# Altium project Test.PrjPcb
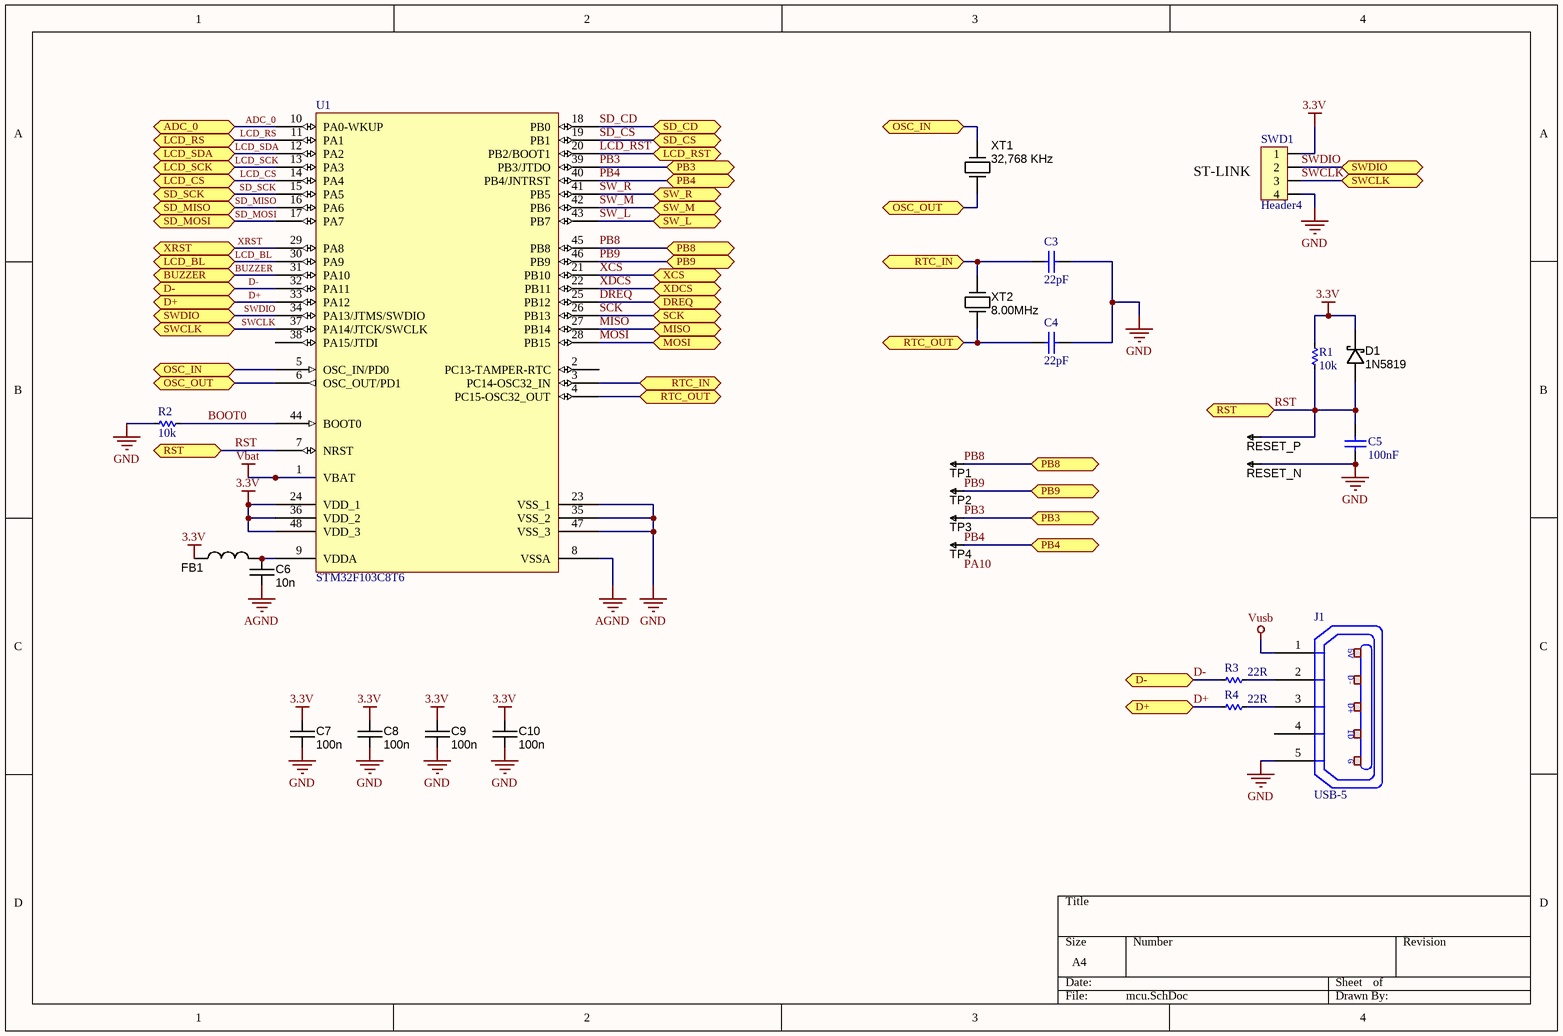
[diagram p0: mcu.SchDoc]
4 sheets, 115 parts. Net scope: flat (ports and power ports of the same name join across sheets).
Board file: PCB.PcbDoc
Sheets:
  mcu.SchDoc
  vs1003.SchDoc
  multimedia.SchDoc
  psu.SchDoc

## Sheet mcu.SchDoc
size A4

### Parts
C3  value 22pF  [C0805]  (hidden comment: Cap Semi)
C4  value 22pF  [C0805]  (hidden comment: Cap Semi)
C5  value 100nF  [C0805]  (hidden comment: Cap Semi)
C6  value 10n  [CAPC1608X90N]  (hidden comment: approved sub OK)
C7  value 100n  [CAPC1608X90N]  (hidden comment: approved sub OK)
C8  value 100n  [CAPC1608X90N]  (hidden comment: approved sub OK)
C9  value 100n  [CAPC1608X90N]  (hidden comment: approved sub OK)
C10  value 100n  [CAPC1608X90N]  (hidden comment: approved sub OK)
D1  Manufacturer Part Number 1: 1N5819  [SOD123]  (hidden comment: DIODE_SCHOTTKY_40V_1A)
FB1  2K2 @ 100 MHz  [FBC2012N]  (value not drawn)
J1  USB-5  [USB-M1]
R1  value 10k  [RES-SMD-0805]  (hidden comment: Res)
R2  value 10k  [RES-SMD-0603]  (hidden comment: Res)
R3  value 22R  [RES-SMD-0603]  (hidden comment: Res)
R4  value 22R  [RES-SMD-0603]  (hidden comment: Res)
RESET_N  TESTPOINT  [TP-R60]  (value not drawn)  (no BOM)
RESET_P  TESTPOINT  [TP-R60]  (value not drawn)  (no BOM)
SWD1  Header4  [HDR4]
TP1  TESTPOINT  [TP-R60]  (value not drawn)  (no BOM)
TP2  TESTPOINT  [TP-R60]  (value not drawn)  (no BOM)
TP3  TESTPOINT  [TP-R60]  (value not drawn)  (no BOM)
TP4  TESTPOINT  [TP-R60]  (value not drawn)  (no BOM)
U1  STM32F103C8T6  [LQFP48_N]
XT1  32,768 KHz  [CRYSTAL_CMR309T]
XT2  8.00MHz  [CRYSTAL_HC49-US-SM]

### Ports
ADC_0, BUZZER, D+, D-, DREQ, LCD_BL, LCD_CS, LCD_RS, LCD_RST, LCD_SCK, LCD_SDA, MISO, MOSI, OSC_IN, OSC_OUT, PB3, PB4, PB8, PB9, RST, RTC_IN, RTC_OUT, SCK, SD_CD, SD_CS, SD_MISO, SD_MOSI, SD_SCK, SW_L, SW_M, SW_R, SWCLK, SWDIO, XCS, XDCS, XRST

### Nets
3.3V: C7.1 C8.1 C9.1 C10.1 D1.K FB1.1 R1.1 SWD1.1 U1.24(VDD_1) U1.36(VDD_2) U1.48(VDD_3)
AGND: C6.2 U1.8(VSSA)
GND: C3.1 C4.1 C5.1 C7.2 C8.2 C9.2 C10.2 J1.5(P5) R2.2 RESET_N.1 SWD1.4 U1.23(VSS_1) U1.35(VSS_2) U1.47(VSS_3)
Vbat: U1.1(VBAT)  [project net Charger_Output]
Vusb: J1.1(P1)
ADC_0: U1.10(PA0-WKUP) ; port ADC_0
BOOT0: R2.1 U1.44(BOOT0)
BUZZER: U1.31(PA10) ; port BUZZER
D+: R4.2 U1.33(PA12) ; port D+
D-: R3.2 U1.32(PA11) ; port D-
DREQ: U1.25(PB12) ; port DREQ
LCD_BL: U1.30(PA9) ; port LCD_BL
LCD_CS: U1.14(PA4) ; port LCD_CS
LCD_RS: U1.11(PA1) ; port LCD_RS
LCD_RST: U1.20(PB2/BOOT1) ; port LCD_RST
LCD_SCK: U1.13(PA3) ; port LCD_SCK
LCD_SDA: U1.12(PA2) ; port LCD_SDA
MISO: U1.27(PB14) ; port MISO
MOSI: U1.28(PB15) ; port MOSI
PB3: TP3.1 U1.39(PB3/JTDO) ; port PB3
PB4: TP4.1 U1.40(PB4/JNTRST) ; port PB4
PB8: TP1.1 U1.45(PB8) ; port PB8
PB9: TP2.1 U1.46(PB9) ; port PB9
RST: C5.2 D1.A R1.2 RESET_P.1 U1.7(NRST) ; port RST
SCK: U1.26(PB13) ; port SCK
SD_CD: U1.18(PB0) ; port SD_CD
SD_CS: U1.19(PB1) ; port SD_CS
SD_MISO: U1.16(PA6) ; port SD_MISO
SD_MOSI: U1.17(PA7) ; port SD_MOSI
SD_SCK: U1.15(PA5) ; port SD_SCK
SW_L: U1.43(PB7) ; port SW_L
SW_M: U1.42(PB6) ; port SW_M
SW_R: U1.41(PB5) ; port SW_R
SWCLK: SWD1.3 U1.37(PA14/JTCK/SWCLK) ; port SWCLK
SWDIO: SWD1.2 U1.34(PA13/JTMS/SWDIO) ; port SWDIO
XCS: U1.21(PB10) ; port XCS
XDCS: U1.22(PB11) ; port XDCS
XRST: U1.29(PA8) ; port XRST
NetC3_2: C3.2 U1.3(PC14-OSC32_IN) XT2.2(OUT) ; port RTC_IN
NetC4_2: C4.2 U1.4(PC15-OSC32_OUT) XT2.1(IN) ; port RTC_OUT
NetC6_1: C6.1 FB1.2 U1.9(VDDA)
NetJ1_2: J1.2(P2) R3.1
NetJ1_3: J1.3(P3) R4.1
NetU1_5: U1.5(OSC_IN/PD0) XT1.2(OUT) ; port OSC_IN
NetU1_6: U1.6(OSC_OUT/PD1) XT1.1(IN) ; port OSC_OUT

Not connected (* = marked no-connect by the designer): J1 4(P4); U1 2(PC13-TAMPER-RTC) 38(PA15/JTDI)

### Notes on the sheet
- (near SWD1) ST-LINK
- Labels drawn without touching a wire or pin: PA10
- (in symbol USB-5) 5V; D-; D+; ID; G

### Library data of the parts
C3-C5 = Cap Semi: Capacitor (Semiconductor SIM Model); Published: 8-Jun-2000; LatestRevisionDate: 29-May-2009; LatestRevisionNote: IPC-7351 Footprint Added.; PackageReference: C1206; Publisher: Altium Limited; PackageDescription: Chip Capacitor
C6-C10 = CAPC_100n_0603_X7R_50V_10%: Capacitor SMD Cer 100nF 10% 50V X7R 0603; Manufacturer 1: AVX Corporation; Manufacturer Part Number 1: 06035C104KAT2A; Ratings: 50V; X7R; Material: ceramic; SCDType: spec; Manufacturer 2: TDK Corporation; Manufacturer Part Number 2: C1608X7R1H104K; Package / Case: 0603 (1608 Metric); Tolerance: ±10%; Supplier 1: Digi-Key; Supplier Part Number 1: 478-5052-1-ND; ComponentLink1URL: http://www.avx.com/docs/Catalogs/cx7r.pdf; ComponentLink1Description: http://www.avx.com/docs/Catalogs/cx7r.pdf; Supplier 2: Digi-Key; Supplier Part Number 2: 445-1314-1-ND; ComponentLink2URL: http://product.tdk.com/capacitor/mlcc/en/documents/mlcc_commercial_general_en.pdf; ComponentLink2Description: http://product.tdk.com/capacitor/mlcc/en/documents/mlcc_commercial_general_en.pdf
D1 = DIODE_SCHOTTKY_40V_1A: Diode Schottky SMD 40V 1A SOD123; Manufacturer 1: Diodes Inc; Ratings: 40V; 1A; Material: Si; SCDType: spec; Package / Case: SOD123; Diode Type: Schottky; Mounting Type: Surface Mount; Supplier 1: Digi-Key; Supplier Part Number 1: 1N5819HW-FDICT-ND
FB1 = FERRITE_2K2-100MHz_0805: Ferrite bead 2.2K Ohm at 100 MHz 200mA 0805 SMD; Manufacturer 1: Laird-Signal Integrity Products; Manufacturer Part Number 1: HZ0805B222R-10; Ratings: 200 mA; 800 mOhm DC; Impedance @ Frequency: 600 Ohm @ 100MHz; DC Resistance (DCR): 800 mOhm Max; Filter Type: Differential Mode - Single; SCDType: source; Size / Dimension: 0.063" L x 0.031" W (1.60mm x 0.80mm); Current Rating: 200mA; Package / Case: 0805 (2012 Metric); Height (Max): 0.043" (1.09mm); ComponentLink1URL: http://www.lairdtech.com/WorkArea/linkit.aspx?LinkIdentifier=id&ItemID=4879; ComponentLink1Description: http://www.lairdtech.com/WorkArea/linkit.aspx?LinkIdentifier=id&ItemID=4879; Supplier 1: Digi-Key; Supplier Part Number 1: 240-2562-1-ND; Mounting Type: Surface Mount; Value: 2K2 @ 100 MHz
J1 = USB-5: Manufacturer: FCI; Manufacturer Part Number: 10118193-0001LF; Connector Type: USB - micro B; Number of Contacts: 5; Gender: Receptacle; Specifications: USB 2.0; .Creator: MM; .Checked PCB: RF; Supplier 1: Digi-Key; RoHS: RoHS Compliant; Category: Connectors, Interconnects; Stock 1: 28642; Pricing 1: 1=0.46, 10=0.433, 25=0.3712, 50=0.3156, 100=0.3032, 250=0.27224, 500=0.25988 (USD); Packaging: Cut Tape (CT); Mounting Type: Surface Mount, Right Angle, Horizontal; Features: Shielded, Solder Retention; Ingress Protection: -; ComponentLink1URL: http://portal.fciconnect.com/Comergent//fci/drawing/10118193.pdf; ComponentLink1Description: http://portal.fciconnect.com/Comergent//fci/drawing/10118193.pdf; Supplier Part Number 1: 609-4616-1-ND; .Checked SCH: MM
R1-R4 = Res-SMD: Resistor; Manufacturer: Generic Components; Class: Passive; Published: 08/06/2000; Publisher: Altium Hobart Technology Centre
RESET_N RESET_P TP1-TP4 = TESTPOINT: SMD test pin
SWD1 = Header4: Header IDC, 4 x 1 Pin Vertical 2.54mm Pitch (Non-Boxed, Male); Manufacturer: W¨¹rth Elektronik eiSos GmbH; partNo: 613002143121; ComponentLink1 Description: Manufacturer; ComponentLink2 Description: Datasheet; NoPins: 02; Created Date: 29 March 2013; ComponentLink1URL: http://www.we-online.com; ComponentLink2URL: http://katalog.we-online.de/em/datasheet/6130xx143121.pdf; Created by: Karrer Zheng
U1 = STM32F103C8T6: STM32 ARM-based 32-bit MCU with 64 Kbytes Flash, 48-pin LQFP, Industrial Temperature; Published: 30-May-2008; DatasheetVersion: rev6, Mar-2008; PackageVersion: Mar-2008; PackageReference: LQFP48; Publisher: Altium Limited; PackageDescription: 48-Pin Low-Profile Quad Flat Pack, 7 x 7 mm Body, 0.5 mm Pitch (LQFP48); ComponentLink1Description: Manufacturer Link; ComponentLink1URL: www.st.com/stm32; ComponentLink2Description: Datasheet; ComponentLink2URL: http://www.st.com/stonline/products/literature/ds/13587.pdf
XT1 = Crystal_6MHz_CMR309T: Resonator Ceramic 6.00 MHz 30ppm; Manufacturer 1: Citizen Finetech Miyota; Manufacturer Part Number 1: CMR309T-6.000MABJ-UT; Frequency: 6MHz; Frequency Stability: ±50ppm; Load Capacitance: 18pF; Operating Mode: Fundamental; SCDType: spec; Package / Case: Cylindrical Can, Radial; Ratings: 6.00 MHz; Type: MHz Crystal; Frequency Tolerance: ±30ppm; Operating Temperature: -10°C ~ 60°C; Mounting Type: Surface Mount; Size / Dimension: 0.118" Dia x 0.346" L (3.00mm x 8.80mm); Height: 0.122" (3.10mm); Supplier 1: Digi-Key; Supplier Part Number 1: 300-8348-1-ND; Tolerance: ±50ppm; ComponentLink1URL: http://media.digikey.com/pdf/Data%20Sheets/Citizen%20PDFs/CMR310T%20CMR309T.pdf; ComponentLink1Description: http://media.digikey.com/pdf/Data%20Sheets/Citizen%20PDFs/CMR310T%20CMR309T.pdf; Value: 32,768 KHz
XT2 = Crystal_6MHz_HC49/US: Resonator Ceramic 6.00 MHz 30ppm; Manufacturer 1: CTS-Frequency Controls; Manufacturer Part Number 1: ATS060BSM-1; Frequency: 6MHz; Frequency Stability: ±50ppm; Load Capacitance: 18pF; Operating Mode: Fundamental; Parameter Name: 0.169" (4.30mm); SCDType: spec; Package / Case: HC49/US-SM; Ratings: 6.00 MHz; Supplier 1: Digi-Key; Supplier Part Number 1: CTX882CT-ND; Type: MHz Crystal; Frequency Tolerance: ±30ppm; Operating Temperature: -20°C ~ 70°C; Mounting Type: Surface Mount; Size / Dimension: 0.437" L x 0.190" W (11.10mm x 4.83mm); ComponentLink1URL: http://www.ctscorp.com/components/Datasheets/008-0309-0.pdf; ComponentLink1Description: http://www.ctscorp.com/components/Datasheets/008-0309-0.pdf

## Sheet vs1003.SchDoc
size A4
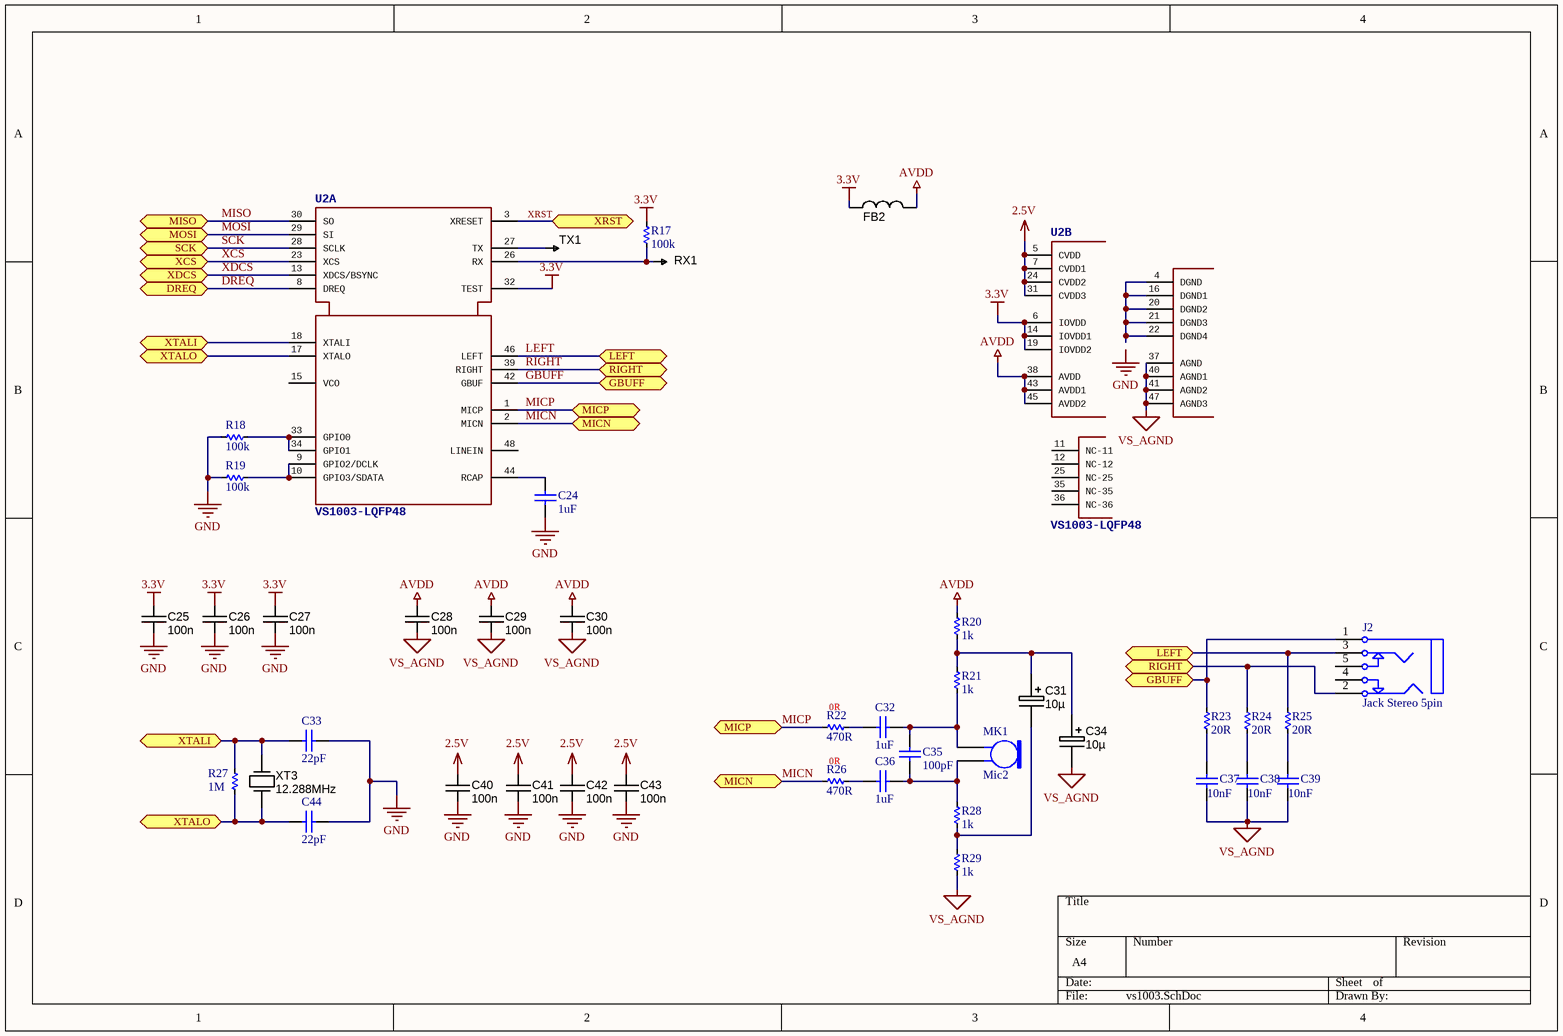
[diagram p1: vs1003.SchDoc]

### Parts
C24  value 1uF  [C0805]  (hidden comment: Cap Semi)
C25  value 100n  [CAPC1608X90N]  (hidden comment: approved sub OK)
C26  value 100n  [CAPC1608X90N]  (hidden comment: approved sub OK)
C27  value 100n  [CAPC1608X90N]  (hidden comment: approved sub OK)
C28  value 100n  [CAPC1608X90N]  (hidden comment: approved sub OK)
C29  value 100n  [CAPC1608X90N]  (hidden comment: approved sub OK)
C30  value 100n  [CAPC1608X90N]  (hidden comment: approved sub OK)
C31  10µ  [CAPMP3216X180N]
C32  value 1uF  [C0805]  (hidden comment: Cap Semi)
C33  value 22pF  [C0805]  (hidden comment: Cap Semi)
C34  10µ  [CAPMP3216X180N]
C35  value 100pF  [C0805]  (hidden comment: Cap Semi)
C36  value 1uF  [C0805]  (hidden comment: Cap Semi)
C37  value 10nF  [C0805]  (hidden comment: Cap Semi)
C38  value 10nF  [C0805]  (hidden comment: Cap Semi)
C39  value 10nF  [C0805]  (hidden comment: Cap Semi)
C40  value 100n  [CAPC1608X90N]  (hidden comment: approved sub OK)
C41  value 100n  [CAPC1608X90N]  (hidden comment: approved sub OK)
C42  value 100n  [CAPC1608X90N]  (hidden comment: approved sub OK)
C43  value 100n  [CAPC1608X90N]  (hidden comment: approved sub OK)
C44  value 22pF  [C0805]  (hidden comment: Cap Semi)
FB2  2K2 @ 100 MHz  [FBC2012N]  (value not drawn)
J2  Jack Stereo 5pin  [Audio Jack 5 pin]
MK1  Mic2  [PIN2]
R17  value 100k  [RES-SMD-0805]  (hidden comment: Res)
R18  value 100k  [RES-SMD-0603]  (hidden comment: Res)
R19  value 100k  [RES-SMD-0603]  (hidden comment: Res)
R20  value 1k  [RES-SMD-0603]  (hidden comment: Res)
R21  value 1k  [RES-SMD-0603]  (hidden comment: Res)
R22  value 470R  [RES-SMD-0603]  (hidden comment: Res)
R23  value 20R  [RES-SMD-0805]  (hidden comment: Res)
R24  value 20R  [RES-SMD-0805]  (hidden comment: Res)
R25  value 20R  [RES-SMD-0805]  (hidden comment: Res)
R26  value 470R  [RES-SMD-0603]  (hidden comment: Res)
R27  value 1M  [RES-SMD-0805]  (hidden comment: Res)
R28  value 1k  [RES-SMD-0603]  (hidden comment: Res)
R29  value 1k  [RES-SMD-0603]  (hidden comment: Res)
RX1  TESTPOINT  [TP-R60]  (value not drawn)  (no BOM)
TX1  TESTPOINT  [TP-R60]  (value not drawn)  (no BOM)
U2  VS1003-LQFP48  [LQFP48]  (parts A,B of 2)
XT3  12.288MHz  [CRYSTAL_HC49-US-SM]

### Ports
DREQ, GBUFF, LEFT, MICN, MICP, MISO, MOSI, RIGHT, SCK, XCS, XDCS, XRST, XTALI, XTALO

### Nets
2.5V: C40.1 C41.1 C42.1 C43.1 U2.5(CVDD) U2.7(CVDD1) U2.24(CVDD2) U2.31(CVDD3)
3.3V: C25.1 C26.1 C27.1 FB2.1 R17.1 U2.6(IOVDD) U2.14(IOVDD1) U2.19(IOVDD2) U2.32(TEST)
AVDD: C28.1 C29.1 C30.1 FB2.2 R20.1 U2.38(AVDD) U2.43(AVDD1) U2.45(AVDD2)
GND: C24.1 C25.2 C26.2 C27.2 C33.1 C40.2 C41.2 C42.2 C43.2 C44.1 R18.1 R19.1
VS_AGND: C28.2 C29.2 C30.2 C34.2 C37.1 C38.1 C39.1 R29.2 U2.37(AGND) U2.40(AGND1) U2.41(AGND2) U2.47(AGND3)
DREQ: U2.8(DREQ) ; port DREQ
GBUFF: J2.1 R23.1 U2.42(GBUF) ; port GBUFF
LEFT: J2.3 R25.1 U2.46(LEFT) ; port LEFT
MICN: R26.2 U2.2(MICN) ; port MICN
MICP: R22.2 U2.1(MICP) ; port MICP
MISO: U2.30(SO) ; port MISO
MOSI: U2.29(SI) ; port MOSI
RIGHT: J2.2 R24.1 U2.39(RIGHT) ; port RIGHT
SCK: U2.28(SCLK) ; port SCK
XCS: U2.23(XCS) ; port XCS
XDCS: U2.13(XDCS/BSYNC) ; port XDCS
XRST: U2.3(XRESET) ; port XRST
NetC24_2: C24.2 U2.44(RCAP)
NetC31_1: C31.1 C34.1 R20.2 R21.1
NetC31_2: C31.2 R28.2 R29.1
NetC32_1: C32.1 R22.1
NetC32_2: C32.2 C35.2 MK1.1 R21.2
NetC33_2: C33.2 R27.1 U2.18(XTALI) XT3.2(OUT) ; port XTALI
NetC35_1: C35.1 C36.2 MK1.2 R28.1
NetC36_1: C36.1 R26.1
NetC37_2: C37.2 R23.2
NetC38_2: C38.2 R24.2
NetC39_2: C39.2 R25.2
NetC44_2: C44.2 R27.2 U2.17(XTALO) XT3.1(IN) ; port XTALO
NetR17_2: R17.2 RX1.1 U2.26(RX)
NetR18_2: R18.2 U2.33(GPIO0) U2.34(GPIO1)
NetR19_2: R19.2 U2.9(GPIO2/DCLK) U2.10(GPIO3/SDATA)
NetTX1_1: TX1.1 U2.27(TX)
NetU2_4: U2.4(DGND) U2.16(DGND1) U2.20(DGND2) U2.21(DGND3) U2.22(DGND4)

Not connected (* = marked no-connect by the designer): J2 4 5; U2 11(NC-11) 12(NC-12) 15(VCO) 25(NC-25) 35(NC-35) 36(NC-36) 48(LINEIN)

### Notes on the sheet
- (near R22) 0R
- (near R26) 0R
- Labels drawn without touching a wire or pin: GND

### Library data of the parts
C24 C32 C33 C35-C39 C44 = Cap Semi: Capacitor (Semiconductor SIM Model); Published: 8-Jun-2000; LatestRevisionDate: 29-May-2009; LatestRevisionNote: IPC-7351 Footprint Added.; PackageReference: C1206; Publisher: Altium Limited; PackageDescription: Chip Capacitor
C25-C30 C40-C43 = CAPC_100n_0603_X7R_50V_10%: as C6 on sheet mcu; Manufacturer 2: TDK Corporation; Manufacturer Part Number 2: C1608X7R1H104K; Package / Case: 0603 (1608 Metric); Tolerance: ±10%; Supplier 1: Digi-Key; Supplier Part Number 1: 478-5052-1-ND; ComponentLink1URL: http://www.avx.com/docs/Catalogs/cx7r.pdf; ComponentLink1Description: http://www.avx.com/docs/Catalogs/cx7r.pdf; Supplier 2: Digi-Key; Supplier Part Number 2: 445-1314-1-ND; ComponentLink2URL: http://product.tdk.com/capacitor/mlcc/en/documents/mlcc_commercial_general_en.pdf; ComponentLink2Description: http://product.tdk.com/capacitor/mlcc/en/documents/mlcc_commercial_general_en.pdf
C31 C34 = CAPT_68u_3216_6V3: Capacitor SMD Tantalum 68uF 10% 6.3V EIA 3216-18; Manufacturer 1: Kemet; Manufacturer Part Number 1: T491A686K006AT; Manufacturer Size Code: A; Material: Solid Tantalum; ESR (Equivalent Series Resistance): 4.000 Ohm; SCDType: spec; Package / Case: 1206 (3216 Metric); Ratings: 6.3V; Tolerance: ±10%; Supplier 1: Digi-Key; Supplier Part Number 1: 399-4698-1-ND; Operating Temperature: -55°C ~ 125°C; Size / Dimension: 0.126" L x 0.063" W (3.20mm x 1.60mm); Height - Seated (Max): 0.071" (1.80mm); ComponentLink1URL: http://www.kemet.com/datasheets&T491A686K006AT; ComponentLink1Description: http://www.kemet.com/datasheets&T491A686K006AT; Value: 10µ
FB2 = FERRITE_2K2-100MHz_0805: as FB1 on sheet mcu; Size / Dimension: 0.063" L x 0.031" W (1.60mm x 0.80mm); Current Rating: 200mA; Package / Case: 0805 (2012 Metric); Height (Max): 0.043" (1.09mm); ComponentLink1URL: http://www.lairdtech.com/WorkArea/linkit.aspx?LinkIdentifier=id&ItemID=4879; ComponentLink1Description: http://www.lairdtech.com/WorkArea/linkit.aspx?LinkIdentifier=id&ItemID=4879; Supplier 1: Digi-Key; Supplier Part Number 1: 240-2562-1-ND; Mounting Type: Surface Mount; Value: 2K2 @ 100 MHz
J2 = Jack Stereo 5pin: 3-Conductor Jack with 2 break contacts (normals) and 2 auxiliary make contacts; Published: 5-Jan-2004; LatestRevisionDate: 17-Dec-2003; LatestRevisionNote: PCB Footprint replaced.; DatasheetDocument: 07-Mar-2000; Publisher: Altium Limited; ComponentLink1Description: Manufacturer Link; ComponentLink1URL: http://domino.kycon.com/internet/Products.html
MK1 = Mic2: Microphone; Published: 24-Mar-1999; LatestRevisionDate: 17-Jul-2002; LatestRevisionNote: Re-released for DXP Platform.; PackageReference: PIN2; Publisher: Altium Limited
R17-R29 = Res-SMD: as R1 on sheet mcu; Published: 08/06/2000; Publisher: Altium Hobart Technology Centre
RX1 TX1 = TESTPOINT: SMD test pin
U2 = VS1003-LQFP48: MP3/WMA Audio Codec   http://www.vlsi.fi/fileadmin/datasheets/vlsi/vs1003.pdf
XT3 = Crystal_6MHz_HC49/US: as XT2 on sheet mcu; Package / Case: HC49/US-SM; Ratings: 6.00 MHz; Supplier 1: Digi-Key; Supplier Part Number 1: CTX882CT-ND; Type: MHz Crystal; Frequency Tolerance: ±30ppm; Operating Temperature: -20°C ~ 70°C; Mounting Type: Surface Mount; Size / Dimension: 0.437" L x 0.190" W (11.10mm x 4.83mm); ComponentLink1URL: http://www.ctscorp.com/components/Datasheets/008-0309-0.pdf; ComponentLink1Description: http://www.ctscorp.com/components/Datasheets/008-0309-0.pdf

## Sheet multimedia.SchDoc
size A4
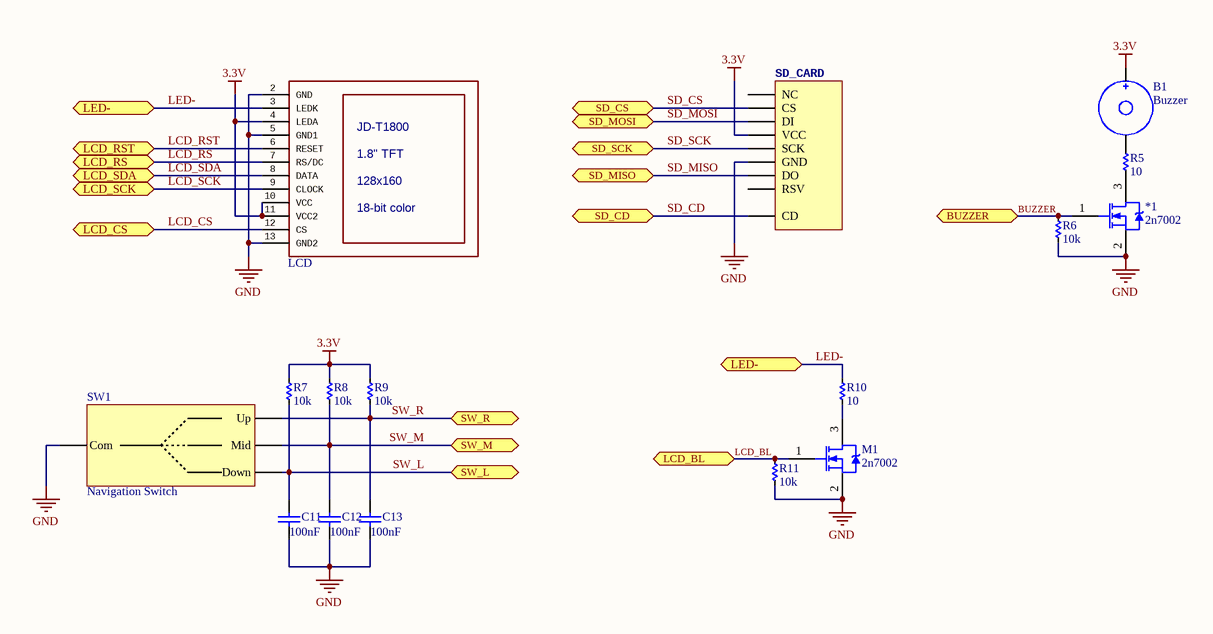
[diagram p2: multimedia.SchDoc]

### Parts
*1  2n7002  [SOT23_N]
B1  Buzzer  [Buzzer1]
C11  value 100nF  [CAPC1608X90N]  (hidden comment: Cap Semi)
C12  value 100nF  [CAPC1608X90N]  (hidden comment: Cap Semi)
C13  value 100nF  [CAPC1608X90N]  (hidden comment: Cap Semi)
LCD  18-bitcolor: 18-bit color  1.8"TFT: 1.8" TFT  [JD-T1800]  (hidden comment: LCD_JD-T1800)
M1  2n7002  [SOT23_N]
R5  value 10  [RES-SMD-0603]  (hidden comment: Res)
R6  value 10k  [RES-SMD-0603]  (hidden comment: Res)
R7  value 10k  [RES-SMD-0603]  (hidden comment: Res)
R8  value 10k  [RES-SMD-0603]  (hidden comment: Res)
R9  value 10k  [RES-SMD-0603]  (hidden comment: Res)
R10  value 10  [RES-SMD-0603]  (hidden comment: Res)
R11  value 10k  [RES-SMD-0603]  (hidden comment: Res)
SD_CARD  USD-SOCKETUSD  [MicroSD-CARD]  (value not drawn)
SW1  Navigation Switch  [Navigation Switch]

### Ports
BUZZER, LCD_BL, LCD_CS, LCD_RS, LCD_RST, LCD_SCK, LCD_SDA, LED-, SD_CD, SD_CS, SD_MISO, SD_MOSI, SD_SCK, SW_L, SW_M, SW_R

### Nets
3.3V: B1.1 LCD.4(LEDA) LCD.10(VCC) LCD.11(VCC2) R7.1 R8.1 R9.1 SD_CARD.4(VCC)
GND: *1.2(S) C11.1 C12.1 C13.1 LCD.2(GND) LCD.5(GND1) LCD.13(GND2) M1.2(S) R6.2 R11.2 SD_CARD.6(GND) SW1.5(Com)
BUZZER: *1.1(G) R6.1 ; port BUZZER
LCD_BL: M1.1(G) R11.1 ; port LCD_BL
LCD_CS: LCD.12(CS) ; port LCD_CS
LCD_RS: LCD.7(RS/DC) ; port LCD_RS
LCD_RST: LCD.6(RESET) ; port LCD_RST
LCD_SCK: LCD.9(CLOCK) ; port LCD_SCK
LCD_SDA: LCD.8(DATA) ; port LCD_SDA
LED-: LCD.3(LEDK) R10.1 ; port LED-
SD_CD: SD_CARD.9(CD) ; port SD_CD
SD_CS: SD_CARD.2(CS) ; port SD_CS
SD_MISO: SD_CARD.7(DO) ; port SD_MISO
SD_MOSI: SD_CARD.3(DI) ; port SD_MOSI
SD_SCK: SD_CARD.5(SCK) ; port SD_SCK
SW_L: C11.2 R7.2 SW1.3(Down) ; port SW_L
SW_M: C12.2 R8.2 SW1.2(Mid) ; port SW_M
SW_R: C13.2 R9.2 SW1.1(Up) ; port SW_R
Net*1_3: *1.3(D) R5.2
NetB1_2: B1.2 R5.1
NetM1_3: M1.3(D) R10.2

Not connected (* = marked no-connect by the designer): SD_CARD 1(NC) 8(RSV)

### Library data of the parts
C11-C13 = Cap Semi: Capacitor (Semiconductor SIM Model); Published: 8-Jun-2000; LatestRevisionDate: 29-May-2009; LatestRevisionNote: IPC-7351 Footprint Added.; PackageReference: C1206; Publisher: Altium Limited; PackageDescription: Chip Capacitor
R5-R11 = Res-SMD: as R1 on sheet mcu; Published: 08/06/2000; Publisher: Altium Hobart Technology Centre
SD_CARD = USD-SOCKETUSD: microSD SocketPush-push type uSD socket. Schematic element and footprint production proven. Spark Fun Electronics SKU : PRT-00127. tDoc lines correctly indicate media card edge positions when inserting (unlocked, locked, depressed). NOTE: CD1 and CD2 are connected internally
LCD = LCD_JD-T1800: JD-T1800: JD-T1800; 128x160: 128x160

## Sheet psu.SchDoc
size A4
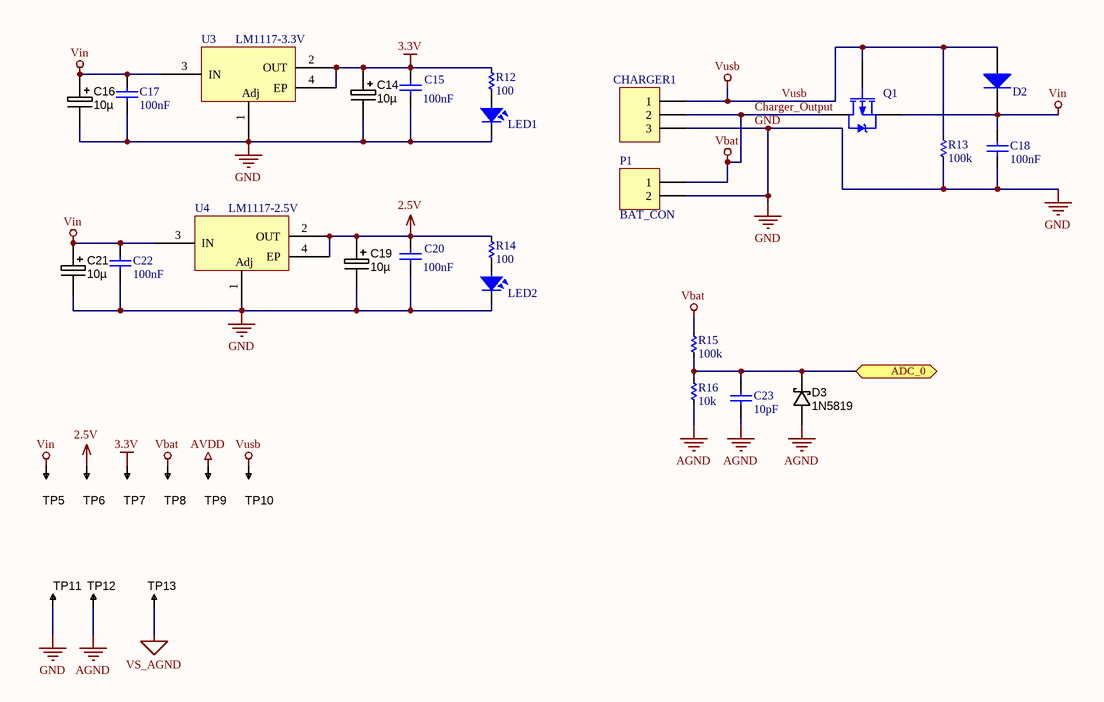
[diagram p3: psu.SchDoc]

### Parts
C14  10µ  [CAPMP3216X180N]
C15  value 100nF  [CAPC1608X90N]  (hidden comment: Cap Semi)
C16  10µ  [CAPMP3216X180N]
C17  value 100nF  [CAPC1608X90N]  (hidden comment: Cap Semi)
C18  value 100nF  [CAPC1608X90N]  (hidden comment: Cap Semi)
C19  10µ  [CAPMP3216X180N]
C20  value 100nF  [CAPC1608X90N]  (hidden comment: Cap Semi)
C21  10µ  [CAPMP3216X180N]
C22  value 100nF  [CAPC1608X90N]  (hidden comment: Cap Semi)
C23  value 10pF  [CAPC1608X90N]  (hidden comment: Cap Semi)
CHARGER1  3-Pin connector  [HDR1X3]  (value not drawn)
D2  Diode  [SMD Diode]  (value not drawn)
D3  Manufacturer Part Number 1: 1N5819  [SOD123]  (hidden comment: DIODE_SCHOTTKY_40V_1A)
LED1  LED  [LED-0805-Red]  (value not drawn)
LED2  LED  [LED-0805-Red]  (value not drawn)
P1  BAT_CON  [HDR1X2]
Q1  IRLML6402  [SOT-23B_N]  (value not drawn)
R12  value 100  [RES-SMD-0603]  (hidden comment: Res)
R13  value 100k  [RES-SMD-1206]  (hidden comment: Res)
R14  value 100  [RES-SMD-0603]  (hidden comment: Res)
R15  value 100k  [RES-SMD-0805]  (hidden comment: Res)
R16  value 10k  [RES-SMD-0805]  (hidden comment: Res)
TP5  TESTPOINT  [TP-R60]  (value not drawn)  (no BOM)
TP6  TESTPOINT  [TP-R60]  (value not drawn)  (no BOM)
TP7  TESTPOINT  [TP-R60]  (value not drawn)  (no BOM)
TP8  TESTPOINT  [TP-R60]  (value not drawn)  (no BOM)
TP9  TESTPOINT  [TP-R60]  (value not drawn)  (no BOM)
TP10  TESTPOINT  [TP-R60]  (value not drawn)  (no BOM)
TP11  TESTPOINT  [TP-R60]  (value not drawn)  (no BOM)
TP12  TESTPOINT  [TP-R60]  (value not drawn)  (no BOM)
TP13  TESTPOINT  [TP-R60]  (value not drawn)  (no BOM)
U3  LM1117-3.3V  [SOT230P700X180-4N]
U4  LM1117-2.5V  [SOT230P700X180-4N]

### Ports
ADC_0

### Nets
2.5V: C19.1 C20.2 R14.1 TP6.1 U4.2(OUT) U4.4(EP)
3.3V: C14.1 C15.2 R12.1 TP7.1 U3.2(OUT) U3.4(EP)
AGND: C23.1 D3.A R16.2 TP12.1
AVDD: TP9.1
Charger_Output: CHARGER1.2 P1.1 Q1.3(D) R15.1 TP8.1  [also labelled Vbat]
GND: C14.2 C15.1 C16.2 C17.1 C18.1 C19.2 C20.1 C21.2 C22.1 CHARGER1.3 LED1.2 LED2.2 P1.2 R13.2 TP11.1 U3.1(ADJ) U4.1(ADJ)
Vin: C16.1 C17.2 C18.2 C21.1 C22.2 D2.2(K) Q1.2(S) TP5.1 U3.3(IN) U4.3(IN)
VS_AGND: TP13.1
Vusb: CHARGER1.1 D2.1(A) Q1.1(G) R13.1 TP10.1
ADC_0: C23.2 D3.K R15.2 R16.1 ; port ADC_0
NetLED1_1: LED1.1 R12.2
NetLED2_1: LED2.1 R14.2

### Notes on the sheet
- (in symbol LM1117-4N) Adj

### Library data of the parts
C14 C16 C19 C21 = CAPT_68u_3216_6V3: as C31 on sheet vs1003; Package / Case: 1206 (3216 Metric); Ratings: 6.3V; Tolerance: ±10%; Supplier 1: Digi-Key; Supplier Part Number 1: 399-4698-1-ND; Operating Temperature: -55°C ~ 125°C; Size / Dimension: 0.126" L x 0.063" W (3.20mm x 1.60mm); Height - Seated (Max): 0.071" (1.80mm); ComponentLink1URL: http://www.kemet.com/datasheets&T491A686K006AT; ComponentLink1Description: http://www.kemet.com/datasheets&T491A686K006AT; Value: 10µ
C15 C17 C18 C20 C22 C23 = Cap Semi: Capacitor (Semiconductor SIM Model); Published: 8-Jun-2000; LatestRevisionDate: 29-May-2009; LatestRevisionNote: IPC-7351 Footprint Added.; PackageReference: C1206; Publisher: Altium Limited; PackageDescription: Chip Capacitor
CHARGER1 = Header 3: Revision: July-2002: Re-released for DXP Platform.
D2 = Diode: SS14, Schottky Diode; Published: 8-Jun-2000; LatestRevisionDate: 17-Jul-2002; LatestRevisionNote: Re-released for DXP Platform.; PackageVersion: Sep-1996; PackageReference: SMC; Publisher: Altium Limited; PackageDescription: DO-214-AB/SMC; 2 C-Bend Leads; Body 7.9 x 5.9 mm, inc. leads (LxW); Code_JEDEC: DO-214-AB
D3 = DIODE_SCHOTTKY_40V_1A: as D1 on sheet mcu; Package / Case: SOD123; Diode Type: Schottky; Mounting Type: Surface Mount; Supplier 1: Digi-Key; Supplier Part Number 1: 1N5819HW-FDICT-ND
LED1 LED2 = LED SMD: Value: LED 3 - 5 ly 2 Colour
P1 = Header 2: Header, 2-Pin; LatestRevisionDate: 17-Jul-2002; LatestRevisionNote: Re-released for DXP Platform.; Publisher: Altium Limited
Q1 = IRLML6402: Note: Pin 2 is electrically connected to pin 4.; Published: 8-Jun-2000; LatestRevisionDate: 17-Jul-2002; LatestRevisionNote: Re-released for DXP Platform.; DatasheetVersion: Aug-1997; PackageVersion: Feb-1997; PackageReference: TO-220AB; Publisher: Altium Limited; PackageDescription: TO, Thru-Hole, Vertical, Heatsink Mounted; 3 In-Line Leads; Pitch 2.54 mm; ComponentLink1Description: Manufacturer Link; ComponentLink1URL: http://www.irf.com/; ComponentLink2Description: Datasheet; ComponentLink2URL: http://www.irf.com/product-info/datasheets/data/irf9z24n.pdf
R12-R16 = Res-SMD: as R1 on sheet mcu; Published: 08/06/2000; Publisher: Altium Hobart Technology Centre
TP5-TP13 = TESTPOINT: SMD test pin
U3 U4 = LM1117-4N

## Nets that join several sheets
2.5V: vs1003 (8 pins), psu (6 pins)
3.3V: mcu (11 pins), vs1003 (9 pins), multimedia (8 pins), psu (6 pins)
AGND: mcu (C6.2 U1.8), psu (C23.1 D3.A R16.2 TP12.1)
AVDD: vs1003 (8 pins), psu (TP9.1)
Charger_Output: mcu (U1.1), psu (5 pins)
GND: mcu (14 pins), vs1003 (12 pins), multimedia (12 pins), psu (17 pins)
VS_AGND: vs1003 (12 pins), psu (TP13.1)
Vusb: mcu (J1.1), psu (5 pins)
ADC_0: mcu (U1.10), psu (C23.2 D3.K R15.2 R16.1)
BUZZER: mcu (U1.31), multimedia (*1.1 R6.1)
DREQ: mcu (U1.25), vs1003 (U2.8)
LCD_BL: mcu (U1.30), multimedia (M1.1 R11.1)
LCD_CS: mcu (U1.14), multimedia (LCD.12)
LCD_RS: mcu (U1.11), multimedia (LCD.7)
LCD_RST: mcu (U1.20), multimedia (LCD.6)
LCD_SCK: mcu (U1.13), multimedia (LCD.9)
LCD_SDA: mcu (U1.12), multimedia (LCD.8)
MISO: mcu (U1.27), vs1003 (U2.30)
MOSI: mcu (U1.28), vs1003 (U2.29)
SCK: mcu (U1.26), vs1003 (U2.28)
SD_CD: mcu (U1.18), multimedia (SD_CARD.9)
SD_CS: mcu (U1.19), multimedia (SD_CARD.2)
SD_MISO: mcu (U1.16), multimedia (SD_CARD.7)
SD_MOSI: mcu (U1.17), multimedia (SD_CARD.3)
SD_SCK: mcu (U1.15), multimedia (SD_CARD.5)
SW_L: mcu (U1.43), multimedia (C11.2 R7.2 SW1.3)
SW_M: mcu (U1.42), multimedia (C12.2 R8.2 SW1.2)
SW_R: mcu (U1.41), multimedia (C13.2 R9.2 SW1.1)
XCS: mcu (U1.21), vs1003 (U2.23)
XDCS: mcu (U1.22), vs1003 (U2.13)
XRST: mcu (U1.29), vs1003 (U2.3)